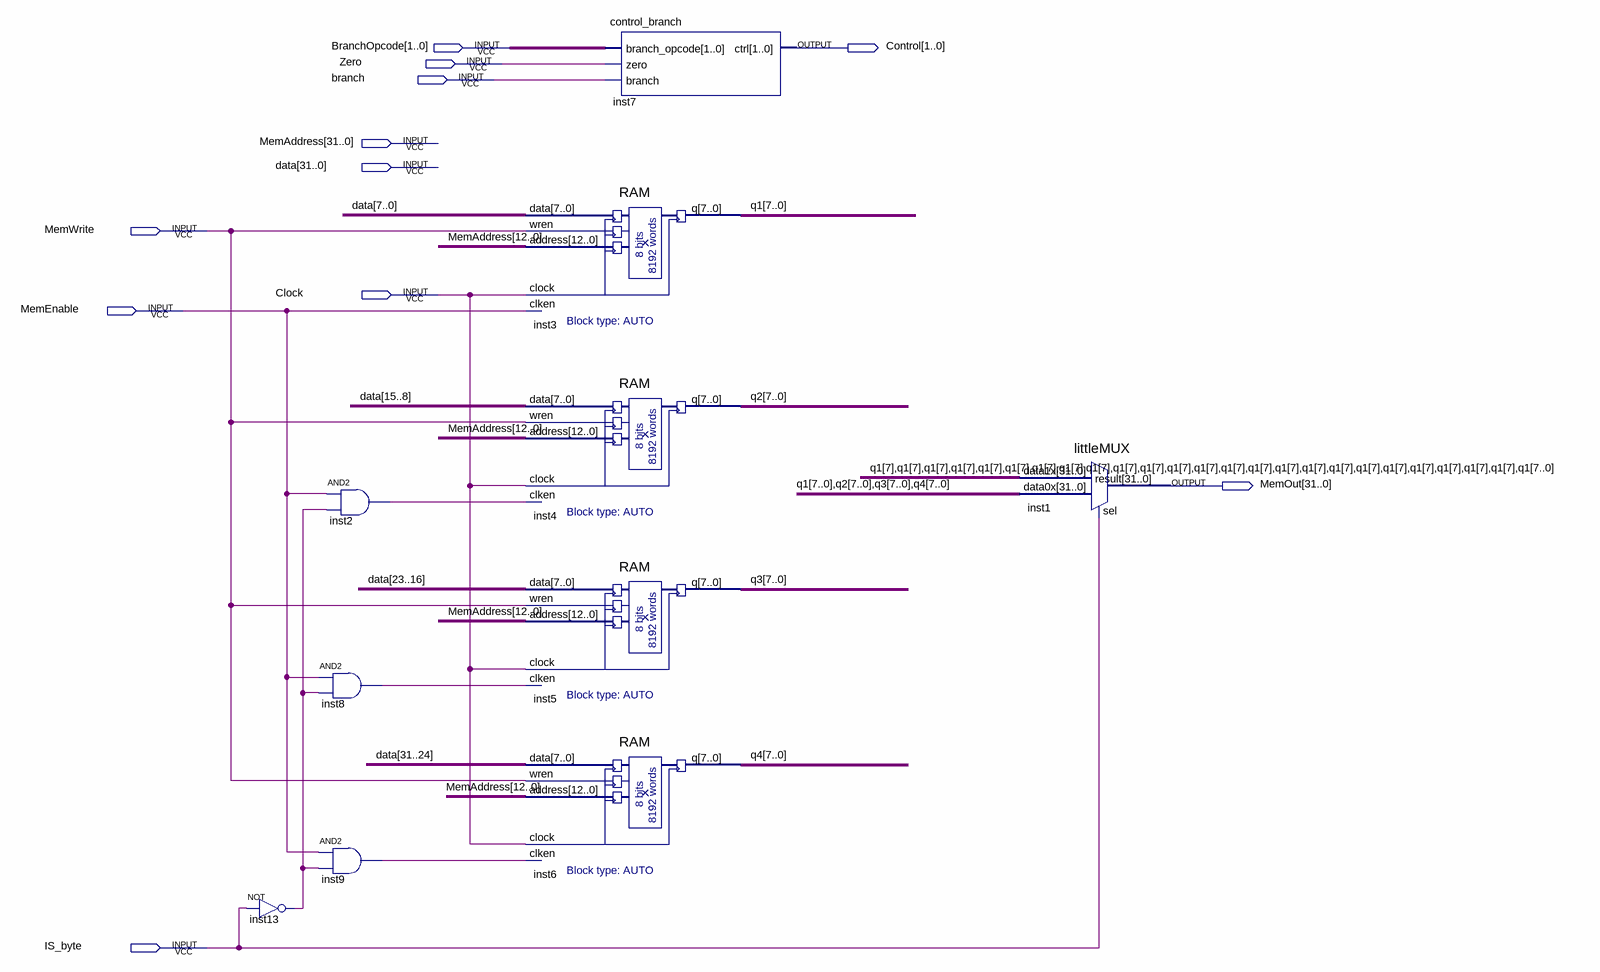
[diagram p0: schematic sheet]
// Quartus schematic MemoryLevel.bdf as structural Verilog: 10 symbols, 11 pins
module MemoryLevel (
  input  [1:0] BranchOpcode,
  input  Zero,
  input  branch,
  input  [31:0] MemAddress,
  input  [31:0] data,
  input  MemWrite,
  input  Clock,
  input  MemEnable,
  input  IS_byte,
  output [1:0] Control,
  output [31:0] MemOut
);

  wire inst2_out, inst8_out, inst9_out, inst13_out;
  wire [7:0] q1, q2, q3, q4;

  not inst13 (inst13_out, IS_byte);
  and inst2 (inst2_out, MemEnable, inst13_out);
  and inst8 (inst8_out, MemEnable, inst13_out);
  and inst9 (inst9_out, MemEnable, inst13_out);
  RAM inst3 (.data(data[7:0]), .wren(MemWrite), .address(MemAddress[12:0]), .clock(Clock), .clken(MemEnable), .q(q1));
  RAM inst4 (.data(data[15:8]), .wren(MemWrite), .address(MemAddress[12:0]), .clock(Clock), .clken(inst2_out), .q(q2));
  RAM inst5 (.data(data[23:16]), .wren(MemWrite), .address(MemAddress[12:0]), .clock(Clock), .clken(inst8_out), .q(q3));
  RAM inst6 (.data(data[31:24]), .wren(MemWrite), .address(MemAddress[12:0]), .clock(Clock), .clken(inst9_out), .q(q4));
  control_branch inst7 (.branch_opcode(BranchOpcode), .zero(Zero), .branch(branch), .ctrl(Control));
  littleMUX inst1 (.data1x({{25{q1[7]}}, q1[6:0]}), .data0x({q1, q2, q3, q4}), .sel(IS_byte), .result(MemOut));
endmodule
